# Altium schematic sheet Transmitter_MD.SchDoc
size A; SheetNumber: 4; SheetTotal: 7
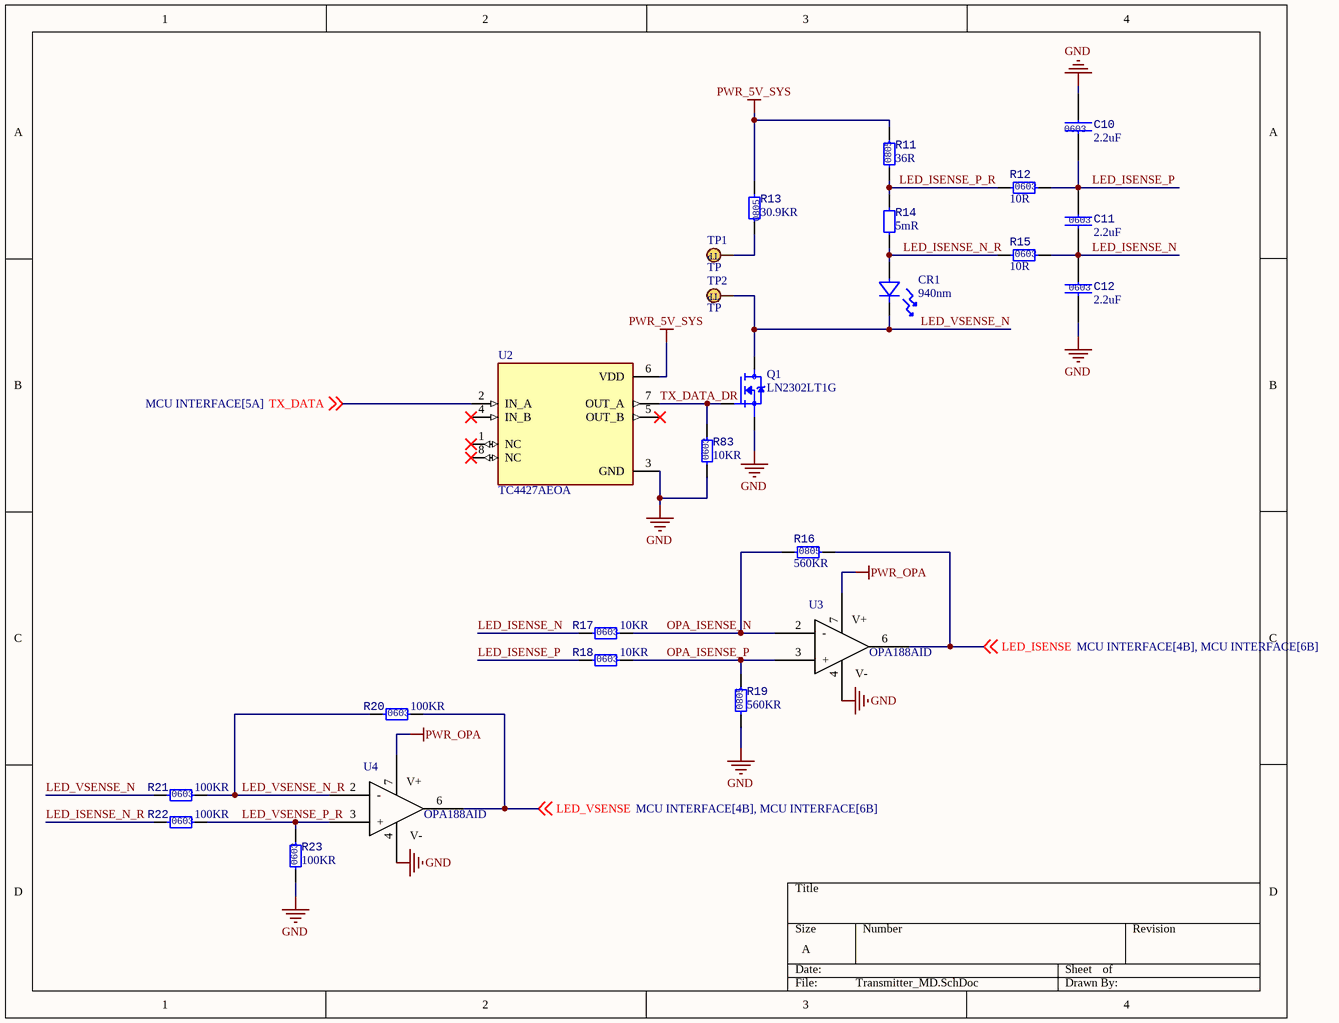
[diagram p0: Transmitter_MD.SchDoc]

## Parts
C10  Size: 0603  [CAPCER 0603 SMD]  (hidden comment: 2.2uF)
C11  Size: 0603  [CAPCER 0603 SMD]  (hidden comment: 2.2uF)
C12  Size: 0603  [CAPCER 0603 SMD]  (hidden comment: 2.2uF)
CR1  value 940nm  [TSAL6100]  (hidden comment: LED IR 940nm)
Q1  value LN2302LT1G  [SOT23-3]  (hidden comment: NMOS)
R11  Size: 0805  [RESC 0805 SMD]  (hidden comment: 36R)
R12  Size: 0603  [RESC 0603(1608) SMD]  (hidden comment: 10R)
R13  Size: 0805  [RESC 0805 SMD]  (hidden comment: 30.9KR)
R14  5mR  [RS_P10_D1P5]
R15  Size: 0603  [RESC 0603(1608) SMD]  (hidden comment: 10R)
R16  Size: 0805  [RESC 0805 SMD]  (hidden comment: 560KR)
R17  Size: 0603  [RESC 0603(1608) SMD]  (hidden comment: 10KR)
R18  Size: 0603  [RESC 0603(1608) SMD]  (hidden comment: 10KR)
R19  Size: 0805  [RESC 0805 SMD]  (hidden comment: 560KR)
R20  Size: 0603  [RESC 0603(1608) SMD]  (hidden comment: 100KR)
R21  Size: 0603  [RESC 0603(1608) SMD]  (hidden comment: 100KR)
R22  Size: 0603  [RESC 0603(1608) SMD]  (hidden comment: 100KR)
R23  Size: 0603  [RESC 0603(1608) SMD]  (hidden comment: 100KR)
R83  Size: 0603  [RESC 0603(1608) SMD]  (hidden comment: 10KR)
TP1  value TP  [TP_THT_1P0]  (hidden comment: TEST POINT)
TP2  value TP  [TP_THT_1P0]  (hidden comment: TEST POINT)
U2  TC4427AEOA  [8-SOIC-OPA]
U3  OPA188AID  [8-SOIC-OPA]
U4  OPA188AID  [8-SOIC-OPA]

## Nets
GND: C10.2 C12.2 Q1.2(S) R19.1 R23.1 R83.1 U2.3(GND) U3.4(GND) U4.4(GND)
PWR_5V_SYS: R11.2 R13.1 U2.6(VDD)
PWR_OPA: U3.7(VCC) U4.7(VCC)
LED_ISENSE: R16.2 U3.6(OUT_1) ; off-sheet LED_ISENSE
LED_ISENSE_N: C11.2 C12.1 R15.2 R17.1
LED_ISENSE_N_R: CR1.A R14.1 R15.1 R22.1
LED_ISENSE_P: C10.1 C11.1 R12.2 R18.1
LED_ISENSE_P_R: R11.1 R12.1 R14.2
LED_VSENSE: R20.2 U4.6(OUT_1) ; off-sheet LED_VSENSE
LED_VSENSE_N: CR1.K Q1.3(D) R21.1 TP2.1
LED_VSENSE_N_R: R20.1 R21.2 U4.2(-)
LED_VSENSE_P_R: R22.2 R23.2 U4.3(+)
OPA_ISENSE_N: R16.1 R17.2 U3.2(-)
OPA_ISENSE_P: R18.2 R19.2 U3.3(+)
TX_DATA: U2.2(IN_A) ; off-sheet TX_DATA
TX_DATA_DR: Q1.1(G) R83.2 U2.7(OUT_A)
NetR13_2: R13.2 TP1.1

Not connected (* = marked no-connect by the designer): U2 1(NC)* 4(IN_B)* 5(OUT_B)* 8(NC)*

## Notes on the sheet
- (in symbol DB-0014) V+; V-

## Library data of the parts
C10-C12 = DB-0027: Tụ Gốm 0603 2.2uF 50V; Design Item ID: DB-0027; Value: 2.2uF; Footprint Type: SMD; Supplier: THEGIOIIC; Supplier Link: https://www.thegioiic.com/tu-gom-0603-2-2uf-50v
CR1 = DB-0016: Type: LED IR; Design Item ID: DB-0016; Footprint Type: DIP; Size: THT; Supplier: THEGIOIIC
Q1 = DB-0018: LN2302LT1G MOSFET Kênh N 20V 2.3A SOT-23-3; Design Item ID: DB-0018; Type: MOSFET; Footprint Type: SMD; Size: SOT23; Supplier: THEGIOIIC
R11 = DB-0017: Power Rate: *; Design Item ID: DB-0017; Value: 36R; Type: RESISTOR; Footprint Type: SMD; Supplier: THEGIOIIC; Supplier Link: https://www.thegioiic.com/dien-tro-36-ohm-0805-5-
R12 R15 = DB-0028: Điện Trở 10 Ohm 0603 1%; Power Rate: *; Design Item ID: DB-0028; Value: 10R; Type: RESISTOR; Footprint Type: SMD; Supplier: THEGIOIIC; Supplier Link: https://www.thegioiic.com/dien-tro-10-ohm-0603-1-
R13 = DB-0012: Điện Trở 30.9 KOhm 0805 1%; Power Rate: *; Design Item ID: DB-0012; Value: 30.9KR; Type: RESISTOR; Footprint Type: SMD; Supplier: THEGIOIIC; Supplier Link: https://www.thegioiic.com/dien-tro-30-9-kohm-0805-1-
R14 = DB-0004: Power Rate: *; Size: ±1%; Design Item ID: DB-0004; Value: 5mR; Footprint Type: THT; Supplier: THEGIOIIC; Supplier Link: https://www.thegioiic.com/dien-tro-sense-0-005-ohm-5mr
R16 R19 = DB-0026: Power Rate: *; Design Item ID: DB-0026; Value: 560KR; Footprint Type: SMD; Supplier: THEGIOIIC
R17 R18 R83 = DB-0003: RESISTOR SMD 10KR OHM 1% 100mW 0603; Power Rate: 100mW; Design Item ID: DB-0003; Value: 10KR; Type: RESISTOR; Tolerance: 1%; Footprint Type: SMD; Supplier: THEGIOIIC; Supplier Part Number: Điện Trở 10 KOhm 0603 1%; Supplier Link: https://www.thegioiic.com/dien-tro-10-kohm-0603-1-
R20-R23 = DB-0008: RESISTOR SMD 100KR OHM 1% 100mW 0603; Power Rate: 100mW; Design Item ID: DB-0008; Value: 100KR; Type: RESISTOR; Tolerance: 1%; Footprint Type: SMD; Supplier: THEGIOIIC; Supplier Part Number: Điện Trở 100 KOhm 0603 1%; Supplier Link: https://www.thegioiic.com/dien-tro-100-kohm-0603-1-
TP1 TP2 = DB-0003: Design Item ID: DB-0003; Type: TP; Footprint Type: THT; Size: 1P0
U2 = DB-0019: Design Item ID: DB-0019; Value: TC4427AEOA; Type: IC DRV FET; Footprint Type: SMD; Size: 8-SOIC; Supplier: THEGIOIIC
U3 U4 = DB-0014: Zero-Drift Amplifier 1 Circuit Rail-to-Rail 8-SOIC; Design Item ID: DB-0014; Value: OPA188AID; Type: IC; Power Rate: N/A; Tolerance: N/A; Footprint Type: SMD; Size: 8-SOIC; Supplier: DIGIKEY; Supplier Part Number: OPA188AID; Supplier Link: https://www.digikey.com/en/products/detail/texas-instruments/OPA188AID/4146941